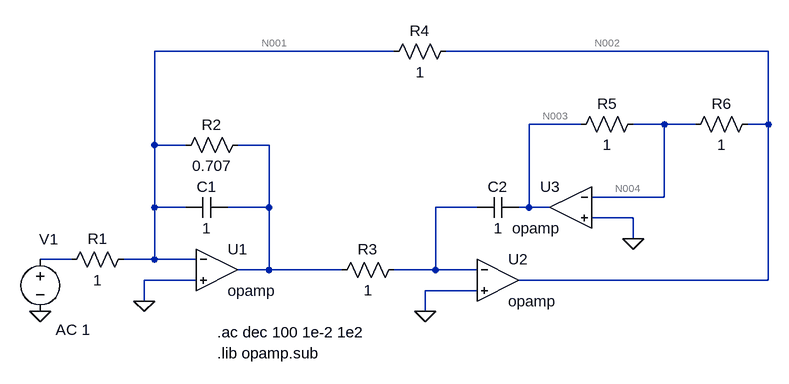
[diagram p0: schematic TPS2_butter.asc]
TPS2_butter.asc, the LTspice schematic file:
Version 4
SHEET 1 880 680
WIRE 112 -64 -256 -64
WIRE 688 -64 192 -64
WIRE 400 48 320 48
WIRE 528 48 480 48
WIRE 576 48 528 48
WIRE 688 48 688 -64
WIRE 688 48 656 48
WIRE -256 80 -256 -64
WIRE -208 80 -256 80
WIRE -80 80 -128 80
WIRE 528 160 528 48
WIRE 528 160 416 160
WIRE -256 176 -256 80
WIRE -208 176 -256 176
WIRE -80 176 -80 80
WIRE -80 176 -144 176
WIRE 240 176 176 176
WIRE 320 176 320 48
WIRE 320 176 304 176
WIRE 352 176 320 176
WIRE 480 192 416 192
WIRE 480 224 480 192
WIRE -384 256 -432 256
WIRE -256 256 -256 176
WIRE -256 256 -304 256
WIRE -192 256 -256 256
WIRE -80 272 -80 176
WIRE -80 272 -128 272
WIRE 32 272 -80 272
WIRE 176 272 176 176
WIRE 176 272 112 272
WIRE 240 272 176 272
WIRE -192 288 -272 288
WIRE 688 288 688 48
WIRE 688 288 304 288
WIRE 240 304 160 304
WIRE -272 320 -272 288
WIRE 160 336 160 304
FLAG -272 320 0
FLAG 160 336 0
FLAG 480 224 0
FLAG -432 336 0
SYMBOL res -288 240 R90
WINDOW 0 0 56 VBottom 2
WINDOW 3 32 56 VTop 2
SYMATTR InstName R1
SYMATTR Value 1
SYMBOL res -112 64 R90
WINDOW 0 0 56 VBottom 2
WINDOW 3 32 56 VTop 2
SYMATTR InstName R2
SYMATTR Value 0.707
SYMBOL cap -144 160 R90
WINDOW 0 0 32 VBottom 2
WINDOW 3 32 32 VTop 2
SYMATTR InstName C1
SYMATTR Value 1
SYMBOL Opamps\\opamp -160 208 R0
SYMATTR InstName U1
SYMBOL res 128 256 R90
WINDOW 0 0 56 VBottom 2
WINDOW 3 32 56 VTop 2
SYMATTR InstName R3
SYMATTR Value 1
SYMBOL cap 304 160 R90
WINDOW 0 0 32 VBottom 2
WINDOW 3 32 32 VTop 2
SYMATTR InstName C2
SYMATTR Value 1
SYMBOL Opamps\\opamp 272 224 R0
SYMATTR InstName U2
SYMBOL Opamps\\opamp 384 112 M0
SYMATTR InstName U3
SYMBOL res 208 -80 R90
WINDOW 0 0 56 VBottom 2
WINDOW 3 32 56 VTop 2
SYMATTR InstName R4
SYMATTR Value 1
SYMBOL res 496 32 R90
WINDOW 0 0 56 VBottom 2
WINDOW 3 32 56 VTop 2
SYMATTR InstName R5
SYMATTR Value 1
SYMBOL res 672 32 R90
WINDOW 0 0 56 VBottom 2
WINDOW 3 32 56 VTop 2
SYMATTR InstName R6
SYMATTR Value 1
SYMBOL voltage -432 240 R0
WINDOW 0 -2 -15 Left 2
WINDOW 123 24 124 Left 2
WINDOW 39 0 0 Left 2
SYMATTR InstName V1
SYMATTR Value2 AC 1
SYMATTR Value ""
TEXT -160 368 Left 2 !.ac dec 100 1e-2 1e2
TEXT -160 400 Left 2 !.lib opamp.sub

The netlist it stands for:
* TPS2_butter.asc
R1 N001 N007 1
R2 N005 N001 0.707
C1 N005 N001 1
XU1 N001 0 N005 opamp Aol=100K GBW=10Meg  ; pins invin noninvin out
R3 N006 N005 1
C2 N003 N006 1
XU2 N006 0 N002 opamp Aol=100K GBW=10Meg  ; pins invin noninvin out
XU3 N004 0 N003 opamp Aol=100K GBW=10Meg  ; pins invin noninvin out
R4 N002 N001 1
R5 N004 N003 1
R6 N002 N004 1
V1 N007 0 AC 1
.ac dec 100 1e-2 1e2
.lib opamp.sub
.backanno
.end

* Results of the author's LTspice run, read from the files saved beside the schematic
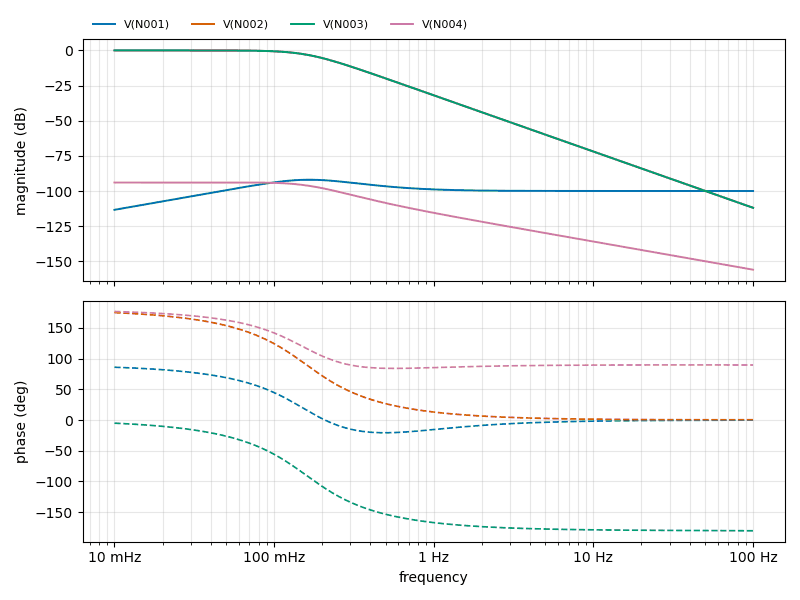
[diagram p1: AC Analysis of TPS2_butter.asc, plotted from the saved traces]
* AC Analysis, 1 run:
*   V(N001): -113.37 dB at 10 mHz, -99.99 dB at 100 Hz, peak -91.97 dB at 166 mHz, 3 dB below the peak at 85.39 mHz and 358.7 mHz
*   V(N002): 0.00 dB at 10 mHz, -111.93 dB at 100 Hz, peak 0.00 dB at 10 mHz, 3 dB below the peak at 159.1 mHz
*   V(N003): -0.00 dB at 10 mHz, -111.93 dB at 100 Hz, peak -0.00 dB at 10 mHz, 3 dB below the peak at 159.1 mHz
*   V(N004): -93.98 dB at 10 mHz, -155.95 dB at 100 Hz, peak -93.91 dB at 56.23 mHz, 3 dB below the peak at 178.8 mHz